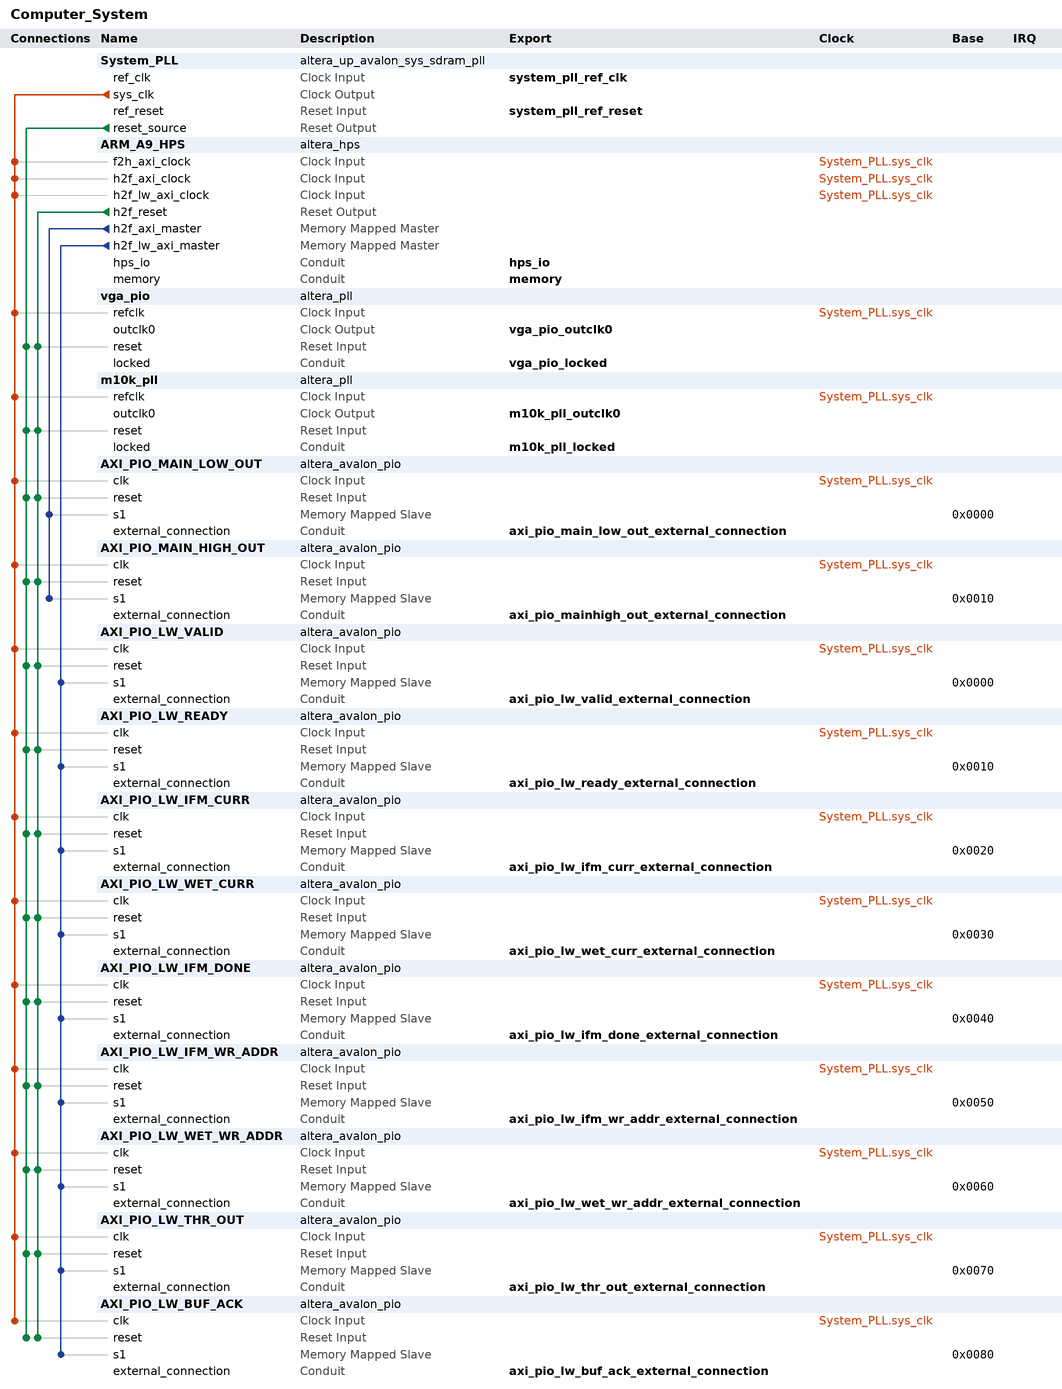
[diagram p0: system contents]
# Platform Designer (Qsys) system Computer_System, Cyclone V 5CSEMA5F31C6
# Parameters at their usual value, and those the tool derives, are not listed.
package require -exact qsys 18.1
create_system Computer_System
set_project_property DEVICE_FAMILY {Cyclone V}
set_project_property DEVICE 5CSEMA5F31C6

add_instance System_PLL altera_up_avalon_sys_sdram_pll 18.0
set_instance_parameter_value System_PLL CV_boards DE1-SoC
set_instance_parameter_value System_PLL gui_outclk 100.0
set_instance_parameter_value System_PLL gui_refclk 50.0

add_instance ARM_A9_HPS altera_hps 18.1
set_instance_parameter_value ARM_A9_HPS EMAC1_Mode RGMII
set_instance_parameter_value ARM_A9_HPS EMAC1_PinMuxing {HPS I/O Set 0}
set_instance_parameter_value ARM_A9_HPS F2SCLK_COLDRST_Enable false
set_instance_parameter_value ARM_A9_HPS F2SCLK_DBGRST_Enable false
set_instance_parameter_value ARM_A9_HPS F2SCLK_WARMRST_Enable false
set_instance_parameter_value ARM_A9_HPS F2SINTERRUPT_Enable true
set_instance_parameter_value ARM_A9_HPS F2S_Width 2
set_instance_parameter_value ARM_A9_HPS FPGA_PERIPHERAL_OUTPUT_CLOCK_FREQ_EMAC0_GTX_CLK 125
set_instance_parameter_value ARM_A9_HPS FPGA_PERIPHERAL_OUTPUT_CLOCK_FREQ_EMAC0_MD_CLK 100.0
set_instance_parameter_value ARM_A9_HPS FPGA_PERIPHERAL_OUTPUT_CLOCK_FREQ_EMAC1_GTX_CLK 125
set_instance_parameter_value ARM_A9_HPS FPGA_PERIPHERAL_OUTPUT_CLOCK_FREQ_EMAC1_MD_CLK 100.0
set_instance_parameter_value ARM_A9_HPS HPS_PROTOCOL DDR3
set_instance_parameter_value ARM_A9_HPS I2C0_Mode I2C
set_instance_parameter_value ARM_A9_HPS I2C0_PinMuxing {HPS I/O Set 0}
set_instance_parameter_value ARM_A9_HPS I2C1_Mode I2C
set_instance_parameter_value ARM_A9_HPS I2C1_PinMuxing {HPS I/O Set 0}
set_instance_parameter_value ARM_A9_HPS LWH2F_Enable true
set_instance_parameter_value ARM_A9_HPS MEM_BANKADDR_WIDTH 3
set_instance_parameter_value ARM_A9_HPS MEM_CLK_FREQ 400.0
set_instance_parameter_value ARM_A9_HPS MEM_COL_ADDR_WIDTH 10
set_instance_parameter_value ARM_A9_HPS MEM_DQ_WIDTH 32
set_instance_parameter_value ARM_A9_HPS MEM_DRV_STR RZQ/7
set_instance_parameter_value ARM_A9_HPS MEM_ROW_ADDR_WIDTH 15
set_instance_parameter_value ARM_A9_HPS MEM_RTT_NOM RZQ/4
set_instance_parameter_value ARM_A9_HPS MEM_RTT_WR RZQ/4
set_instance_parameter_value ARM_A9_HPS MEM_TCL 11
set_instance_parameter_value ARM_A9_HPS MEM_TFAW_NS 30.0
set_instance_parameter_value ARM_A9_HPS MEM_TRAS_NS 35.0
set_instance_parameter_value ARM_A9_HPS MEM_TRCD_NS 13.75
set_instance_parameter_value ARM_A9_HPS MEM_TRFC_NS 260.0
set_instance_parameter_value ARM_A9_HPS MEM_TRP_NS 13.75
set_instance_parameter_value ARM_A9_HPS MEM_VENDOR JEDEC
set_instance_parameter_value ARM_A9_HPS MEM_WTCL 8
set_instance_parameter_value ARM_A9_HPS QSPI_Mode {1 SS}
set_instance_parameter_value ARM_A9_HPS QSPI_PinMuxing {HPS I/O Set 0}
set_instance_parameter_value ARM_A9_HPS REF_CLK_FREQ 25.0
set_instance_parameter_value ARM_A9_HPS S2FCLK_USER2CLK 5
set_instance_parameter_value ARM_A9_HPS S2F_Width 3
set_instance_parameter_value ARM_A9_HPS SDIO_Mode {4-bit Data}
set_instance_parameter_value ARM_A9_HPS SDIO_PinMuxing {HPS I/O Set 0}
set_instance_parameter_value ARM_A9_HPS SPIM1_Mode {Single Slave Select}
set_instance_parameter_value ARM_A9_HPS SPIM1_PinMuxing {HPS I/O Set 0}
set_instance_parameter_value ARM_A9_HPS STM_Enable false
set_instance_parameter_value ARM_A9_HPS TIMING_BOARD_AC_SKEW 0.03
set_instance_parameter_value ARM_A9_HPS TIMING_BOARD_AC_TO_CK_SKEW 0.0
set_instance_parameter_value ARM_A9_HPS TIMING_BOARD_DQ_TO_DQS_SKEW 0.0
set_instance_parameter_value ARM_A9_HPS TIMING_BOARD_MAX_CK_DELAY 0.03
set_instance_parameter_value ARM_A9_HPS TIMING_BOARD_MAX_DQS_DELAY 0.02
set_instance_parameter_value ARM_A9_HPS TIMING_BOARD_SKEW_BETWEEN_DQS 0.08
set_instance_parameter_value ARM_A9_HPS TIMING_BOARD_SKEW_CKDQS_DIMM_MAX 0.16
set_instance_parameter_value ARM_A9_HPS TIMING_BOARD_SKEW_CKDQS_DIMM_MIN 0.09
set_instance_parameter_value ARM_A9_HPS TIMING_BOARD_SKEW_WITHIN_DQS 0.01
set_instance_parameter_value ARM_A9_HPS TIMING_TDH 65
set_instance_parameter_value ARM_A9_HPS TIMING_TDQSCK 255
set_instance_parameter_value ARM_A9_HPS TIMING_TDQSQ 125
set_instance_parameter_value ARM_A9_HPS TIMING_TDS 30
set_instance_parameter_value ARM_A9_HPS TIMING_TIH 140
set_instance_parameter_value ARM_A9_HPS TIMING_TIS 180
set_instance_parameter_value ARM_A9_HPS TIMING_TQSH 0.4
set_instance_parameter_value ARM_A9_HPS UART0_Mode {No Flow Control}
set_instance_parameter_value ARM_A9_HPS UART0_PinMuxing {HPS I/O Set 0}
set_instance_parameter_value ARM_A9_HPS USB1_Mode SDR
set_instance_parameter_value ARM_A9_HPS USB1_PinMuxing {HPS I/O Set 0}
set_instance_parameter_value ARM_A9_HPS desired_cfg_clk_mhz 100.0
set_instance_parameter_value ARM_A9_HPS desired_qspi_clk_mhz 400.0

add_instance vga_pio altera_pll 18.1
set_instance_parameter_value vga_pio gui_device_speed_grade 2
set_instance_parameter_value vga_pio gui_number_of_clocks 1
set_instance_parameter_value vga_pio gui_operation_mode direct
set_instance_parameter_value vga_pio gui_output_clock_frequency0 25.0
set_instance_parameter_value vga_pio gui_pll_mode {Integer-N PLL}
set_instance_parameter_value vga_pio gui_reference_clock_frequency 100.0
set_instance_parameter_value vga_pio gui_use_locked true

add_instance m10k_pll altera_pll 18.1
set_instance_parameter_value m10k_pll gui_device_speed_grade 2
set_instance_parameter_value m10k_pll gui_number_of_clocks 1
set_instance_parameter_value m10k_pll gui_operation_mode direct
set_instance_parameter_value m10k_pll gui_output_clock_frequency0 100.0
set_instance_parameter_value m10k_pll gui_pll_mode {Integer-N PLL}
set_instance_parameter_value m10k_pll gui_reference_clock_frequency 100.0
set_instance_parameter_value m10k_pll gui_use_locked true

add_instance AXI_PIO_MAIN_LOW_OUT altera_avalon_pio 18.1
set_instance_parameter_value AXI_PIO_MAIN_LOW_OUT direction Output
set_instance_parameter_value AXI_PIO_MAIN_LOW_OUT width 32

add_instance AXI_PIO_MAIN_HIGH_OUT altera_avalon_pio 18.1
set_instance_parameter_value AXI_PIO_MAIN_HIGH_OUT direction Output
set_instance_parameter_value AXI_PIO_MAIN_HIGH_OUT width 32

add_instance AXI_PIO_LW_VALID altera_avalon_pio 18.1
set_instance_parameter_value AXI_PIO_LW_VALID direction Output
set_instance_parameter_value AXI_PIO_LW_VALID width 1

add_instance AXI_PIO_LW_READY altera_avalon_pio 18.1
set_instance_parameter_value AXI_PIO_LW_READY direction Input
set_instance_parameter_value AXI_PIO_LW_READY width 1

add_instance AXI_PIO_LW_IFM_CURR altera_avalon_pio 18.1
set_instance_parameter_value AXI_PIO_LW_IFM_CURR direction Output
set_instance_parameter_value AXI_PIO_LW_IFM_CURR width 1

add_instance AXI_PIO_LW_WET_CURR altera_avalon_pio 18.1
set_instance_parameter_value AXI_PIO_LW_WET_CURR direction Output
set_instance_parameter_value AXI_PIO_LW_WET_CURR width 1

add_instance AXI_PIO_LW_IFM_DONE altera_avalon_pio 18.1
set_instance_parameter_value AXI_PIO_LW_IFM_DONE direction Output
set_instance_parameter_value AXI_PIO_LW_IFM_DONE width 1

add_instance AXI_PIO_LW_IFM_WR_ADDR altera_avalon_pio 18.1
set_instance_parameter_value AXI_PIO_LW_IFM_WR_ADDR direction Output
set_instance_parameter_value AXI_PIO_LW_IFM_WR_ADDR width 16

add_instance AXI_PIO_LW_WET_WR_ADDR altera_avalon_pio 18.1
set_instance_parameter_value AXI_PIO_LW_WET_WR_ADDR direction Output
set_instance_parameter_value AXI_PIO_LW_WET_WR_ADDR width 16

add_instance AXI_PIO_LW_THR_OUT altera_avalon_pio 18.1
set_instance_parameter_value AXI_PIO_LW_THR_OUT direction Output
set_instance_parameter_value AXI_PIO_LW_THR_OUT width 32

add_instance AXI_PIO_LW_BUF_ACK altera_avalon_pio 18.1
set_instance_parameter_value AXI_PIO_LW_BUF_ACK direction Input
set_instance_parameter_value AXI_PIO_LW_BUF_ACK width 1

# connections
add_connection System_PLL.sys_clk ARM_A9_HPS.f2h_axi_clock clock
add_connection System_PLL.sys_clk ARM_A9_HPS.h2f_axi_clock clock
add_connection System_PLL.sys_clk ARM_A9_HPS.h2f_lw_axi_clock clock
add_connection System_PLL.sys_clk AXI_PIO_LW_BUF_ACK.clk clock
add_connection System_PLL.sys_clk AXI_PIO_LW_IFM_CURR.clk clock
add_connection System_PLL.sys_clk AXI_PIO_LW_IFM_DONE.clk clock
add_connection System_PLL.sys_clk AXI_PIO_LW_IFM_WR_ADDR.clk clock
add_connection System_PLL.sys_clk AXI_PIO_LW_READY.clk clock
add_connection System_PLL.sys_clk AXI_PIO_LW_THR_OUT.clk clock
add_connection System_PLL.sys_clk AXI_PIO_LW_VALID.clk clock
add_connection System_PLL.sys_clk AXI_PIO_LW_WET_CURR.clk clock
add_connection System_PLL.sys_clk AXI_PIO_LW_WET_WR_ADDR.clk clock
add_connection System_PLL.sys_clk AXI_PIO_MAIN_HIGH_OUT.clk clock
add_connection System_PLL.sys_clk AXI_PIO_MAIN_LOW_OUT.clk clock
add_connection System_PLL.sys_clk m10k_pll.refclk clock
add_connection System_PLL.sys_clk vga_pio.refclk clock
add_connection ARM_A9_HPS.h2f_reset AXI_PIO_LW_BUF_ACK.reset reset
add_connection ARM_A9_HPS.h2f_reset AXI_PIO_LW_IFM_CURR.reset reset
add_connection ARM_A9_HPS.h2f_reset AXI_PIO_LW_IFM_DONE.reset reset
add_connection ARM_A9_HPS.h2f_reset AXI_PIO_LW_IFM_WR_ADDR.reset reset
add_connection ARM_A9_HPS.h2f_reset AXI_PIO_LW_READY.reset reset
add_connection ARM_A9_HPS.h2f_reset AXI_PIO_LW_THR_OUT.reset reset
add_connection ARM_A9_HPS.h2f_reset AXI_PIO_LW_VALID.reset reset
add_connection ARM_A9_HPS.h2f_reset AXI_PIO_LW_WET_CURR.reset reset
add_connection ARM_A9_HPS.h2f_reset AXI_PIO_LW_WET_WR_ADDR.reset reset
add_connection ARM_A9_HPS.h2f_reset AXI_PIO_MAIN_HIGH_OUT.reset reset
add_connection ARM_A9_HPS.h2f_reset AXI_PIO_MAIN_LOW_OUT.reset reset
add_connection ARM_A9_HPS.h2f_reset m10k_pll.reset reset
add_connection ARM_A9_HPS.h2f_reset vga_pio.reset reset
add_connection System_PLL.reset_source AXI_PIO_LW_BUF_ACK.reset reset
add_connection System_PLL.reset_source AXI_PIO_LW_IFM_CURR.reset reset
add_connection System_PLL.reset_source AXI_PIO_LW_IFM_DONE.reset reset
add_connection System_PLL.reset_source AXI_PIO_LW_IFM_WR_ADDR.reset reset
add_connection System_PLL.reset_source AXI_PIO_LW_READY.reset reset
add_connection System_PLL.reset_source AXI_PIO_LW_THR_OUT.reset reset
add_connection System_PLL.reset_source AXI_PIO_LW_VALID.reset reset
add_connection System_PLL.reset_source AXI_PIO_LW_WET_CURR.reset reset
add_connection System_PLL.reset_source AXI_PIO_LW_WET_WR_ADDR.reset reset
add_connection System_PLL.reset_source AXI_PIO_MAIN_HIGH_OUT.reset reset
add_connection System_PLL.reset_source AXI_PIO_MAIN_LOW_OUT.reset reset
add_connection System_PLL.reset_source m10k_pll.reset reset
add_connection System_PLL.reset_source vga_pio.reset reset
add_connection ARM_A9_HPS.h2f_axi_master AXI_PIO_MAIN_HIGH_OUT.s1 avalon
set_connection_parameter_value ARM_A9_HPS.h2f_axi_master/AXI_PIO_MAIN_HIGH_OUT.s1 baseAddress 0x0010
add_connection ARM_A9_HPS.h2f_axi_master AXI_PIO_MAIN_LOW_OUT.s1 avalon
set_connection_parameter_value ARM_A9_HPS.h2f_axi_master/AXI_PIO_MAIN_LOW_OUT.s1 baseAddress 0x0000
add_connection ARM_A9_HPS.h2f_lw_axi_master AXI_PIO_LW_BUF_ACK.s1 avalon
set_connection_parameter_value ARM_A9_HPS.h2f_lw_axi_master/AXI_PIO_LW_BUF_ACK.s1 baseAddress 0x0080
add_connection ARM_A9_HPS.h2f_lw_axi_master AXI_PIO_LW_IFM_CURR.s1 avalon
set_connection_parameter_value ARM_A9_HPS.h2f_lw_axi_master/AXI_PIO_LW_IFM_CURR.s1 baseAddress 0x0020
add_connection ARM_A9_HPS.h2f_lw_axi_master AXI_PIO_LW_IFM_DONE.s1 avalon
set_connection_parameter_value ARM_A9_HPS.h2f_lw_axi_master/AXI_PIO_LW_IFM_DONE.s1 baseAddress 0x0040
add_connection ARM_A9_HPS.h2f_lw_axi_master AXI_PIO_LW_IFM_WR_ADDR.s1 avalon
set_connection_parameter_value ARM_A9_HPS.h2f_lw_axi_master/AXI_PIO_LW_IFM_WR_ADDR.s1 baseAddress 0x0050
add_connection ARM_A9_HPS.h2f_lw_axi_master AXI_PIO_LW_READY.s1 avalon
set_connection_parameter_value ARM_A9_HPS.h2f_lw_axi_master/AXI_PIO_LW_READY.s1 baseAddress 0x0010
add_connection ARM_A9_HPS.h2f_lw_axi_master AXI_PIO_LW_THR_OUT.s1 avalon
set_connection_parameter_value ARM_A9_HPS.h2f_lw_axi_master/AXI_PIO_LW_THR_OUT.s1 baseAddress 0x0070
add_connection ARM_A9_HPS.h2f_lw_axi_master AXI_PIO_LW_VALID.s1 avalon
set_connection_parameter_value ARM_A9_HPS.h2f_lw_axi_master/AXI_PIO_LW_VALID.s1 baseAddress 0x0000
add_connection ARM_A9_HPS.h2f_lw_axi_master AXI_PIO_LW_WET_CURR.s1 avalon
set_connection_parameter_value ARM_A9_HPS.h2f_lw_axi_master/AXI_PIO_LW_WET_CURR.s1 baseAddress 0x0030
add_connection ARM_A9_HPS.h2f_lw_axi_master AXI_PIO_LW_WET_WR_ADDR.s1 avalon
set_connection_parameter_value ARM_A9_HPS.h2f_lw_axi_master/AXI_PIO_LW_WET_WR_ADDR.s1 baseAddress 0x0060

# exported interfaces
add_interface axi_pio_lw_buf_ack_external_connection conduit end
set_interface_property axi_pio_lw_buf_ack_external_connection EXPORT_OF AXI_PIO_LW_BUF_ACK.external_connection
add_interface axi_pio_lw_ifm_curr_external_connection conduit end
set_interface_property axi_pio_lw_ifm_curr_external_connection EXPORT_OF AXI_PIO_LW_IFM_CURR.external_connection
add_interface axi_pio_lw_ifm_done_external_connection conduit end
set_interface_property axi_pio_lw_ifm_done_external_connection EXPORT_OF AXI_PIO_LW_IFM_DONE.external_connection
add_interface axi_pio_lw_ifm_wr_addr_external_connection conduit end
set_interface_property axi_pio_lw_ifm_wr_addr_external_connection EXPORT_OF AXI_PIO_LW_IFM_WR_ADDR.external_connection
add_interface axi_pio_lw_ready_external_connection conduit end
set_interface_property axi_pio_lw_ready_external_connection EXPORT_OF AXI_PIO_LW_READY.external_connection
add_interface axi_pio_lw_thr_out_external_connection conduit end
set_interface_property axi_pio_lw_thr_out_external_connection EXPORT_OF AXI_PIO_LW_THR_OUT.external_connection
add_interface axi_pio_lw_valid_external_connection conduit end
set_interface_property axi_pio_lw_valid_external_connection EXPORT_OF AXI_PIO_LW_VALID.external_connection
add_interface axi_pio_lw_wet_curr_external_connection conduit end
set_interface_property axi_pio_lw_wet_curr_external_connection EXPORT_OF AXI_PIO_LW_WET_CURR.external_connection
add_interface axi_pio_lw_wet_wr_addr_external_connection conduit end
set_interface_property axi_pio_lw_wet_wr_addr_external_connection EXPORT_OF AXI_PIO_LW_WET_WR_ADDR.external_connection
add_interface axi_pio_main_low_out_external_connection conduit end
set_interface_property axi_pio_main_low_out_external_connection EXPORT_OF AXI_PIO_MAIN_LOW_OUT.external_connection
add_interface axi_pio_mainhigh_out_external_connection conduit end
set_interface_property axi_pio_mainhigh_out_external_connection EXPORT_OF AXI_PIO_MAIN_HIGH_OUT.external_connection
add_interface hps_io conduit end
set_interface_property hps_io EXPORT_OF ARM_A9_HPS.hps_io
add_interface m10k_pll_locked conduit end
set_interface_property m10k_pll_locked EXPORT_OF m10k_pll.locked
add_interface m10k_pll_outclk0 clock source
set_interface_property m10k_pll_outclk0 EXPORT_OF m10k_pll.outclk0
add_interface memory conduit end
set_interface_property memory EXPORT_OF ARM_A9_HPS.memory
add_interface system_pll_ref_clk clock sink
set_interface_property system_pll_ref_clk EXPORT_OF System_PLL.ref_clk
add_interface system_pll_ref_reset reset sink
set_interface_property system_pll_ref_reset EXPORT_OF System_PLL.ref_reset
add_interface vga_pio_locked conduit end
set_interface_property vga_pio_locked EXPORT_OF vga_pio.locked
add_interface vga_pio_outclk0 clock source
set_interface_property vga_pio_outclk0 EXPORT_OF vga_pio.outclk0

set_interconnect_requirement {$system} qsys_mm.clockCrossingAdapter HANDSHAKE
set_interconnect_requirement {$system} qsys_mm.enableEccProtection FALSE
set_interconnect_requirement {$system} qsys_mm.insertDefaultSlave FALSE
set_interconnect_requirement {$system} qsys_mm.maxAdditionalLatency 1

save_system Computer_System.qsys
